# Altium project Krets_Brillz_V2.PrjPcb
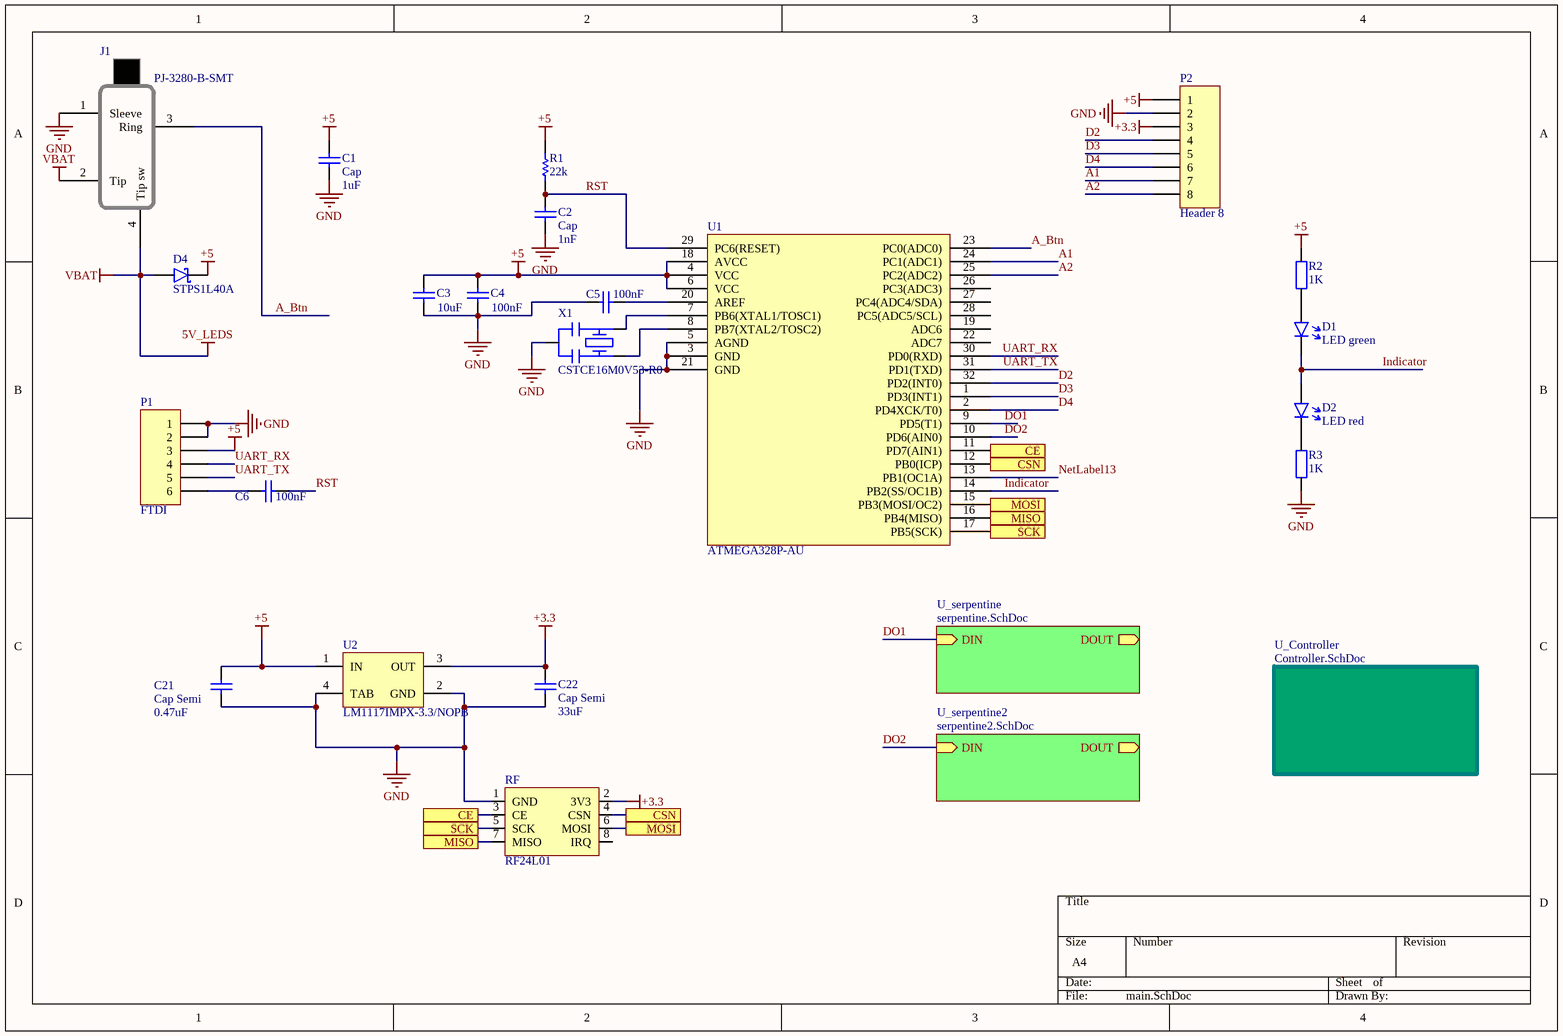
[diagram p0: main.SchDoc]
5 sheets, 147 parts. Net scope: hierarchical (ports join the sheet entries above them; power ports are global).
Board files: SchematicBKP.PcbDoc, PCB1.PcbDoc
Sheets:
  main.SchDoc
    U_Controller = Controller.SchDoc
    U_serpentine = serpentine.SchDoc
      U_Column1 = Column.SchDoc
      U_Column2 = Column.SchDoc
      U_Column3 = Column.SchDoc
      U_Column4 = Column.SchDoc
      U_Column5 = Column.SchDoc
      U_Column6 = Column.SchDoc
      U_Column7 = Column.SchDoc
    U_serpentine2 = serpentine2.SchDoc
      U_Column8 = Column.SchDoc
      U_Column9 = Column.SchDoc
      U_Column10 = Column.SchDoc
      U_Column12 = Column.SchDoc
      U_Column13 = Column.SchDoc
      U_Column14 = Column.SchDoc
      U_Column15 = Column.SchDoc

## Sheet main.SchDoc
size A4

### Parts
(Parts that share a designator on the sheet are numbered #1, #2 ... from top to bottom, then left to right.)
C1  Cap  value 1uF  [6-0805_M]
C2  Cap  value 1nF  [6-0805_N]
C3  value 10uF  [6-0805_N]  (hidden comment: Cap)
C4  value 100nF  [6-0805_N]  (hidden comment: Cap)
C5  value 100nF  [6-0805_N]  (hidden comment: Cap)
C6  value 100nF  [6-0805_N]  (hidden comment: Cap)
C21  Cap Semi  value 0.47uF  [C1206]
C22  Cap Semi  value 33uF  [C1206]
D1  LED green  [LED0805]
D2  LED red  [LED0805]
D4  STPS1L40A  [schottky smd]
J1  PJ-3280-B-SMT  [Phonejack]
P1  FTDI  [HDR1X6H]
P2#1  Header 8  [HDR1X8]
R1  22k  [6-0805_N]
R2  1K  [RES0805]
R3  1K  [RES0805]
RF  RF24L01  [RF]
U1  ATMEGA328P-AU  [TQFP32]
U2  LM1117IMPX-3.3/NOPB  [DCY0004A_N]
X1  CSTCE16M0V53-R0  [osc]

### Sub-sheets
U_Controller = Controller.SchDoc: no entries
U_serpentine = serpentine.SchDoc: DIN (in), DOUT (out)
U_serpentine2 = serpentine2.SchDoc: DIN (in), DOUT (out)

### Ports
CE, CSN, MISO, MOSI, SCK

### Nets
5V_LEDS: D4.1(A) J1.2(Tip) J1.4(Tip_sw)  [also labelled VBAT]
+3.3: C22.2 P2#1.3 RF.2(3V3) U2.3(OUT)
+5: C1.1 C3.1 C4.1 C21.2 D4.2(C) P1.3 P2#1.1 R1.2 R2.1 U1.4(VCC) U1.6(VCC) U1.18(AVCC) U2.1(IN)
GND: C1.2 C2.1 C3.2 C4.2 C5.2 C21.1 C22.1 J1.1(Sleeve) P1.1 P1.2 P2#1.2 R3.2 RF.1(GND) U1.3(GND) U1.5(AGND) U1.21(GND) U2.2(GND) U2.4(TAB) X1.GND
A1: P2#1.7 U1.24(PC1(ADC1))
A2: P2#1.8 U1.25(PC2(ADC2))
A_Btn: J1.3(Ring) U1.23(PC0(ADC0))
D2: P2#1.4 U1.32(PD2(INT0))
D3: P2#1.5 U1.1(PD3(INT1))
D4: P2#1.6 U1.2(PD4XCK/T0))
DO1: U1.9(PD5(T1)) ; sheet U_serpentine/DIN
DO2: U1.10(PD6(AIN0)) ; sheet U_serpentine2/DIN
Indicator: D1.2 D2.1(A) U1.14(PB2(SS/OC1B))
NetLabel13: U1.13(PB1(OC1A))
RST: C2.2 C6.1 R1.1 U1.29(PC6(RESET))
UART_RX: P1.4 U1.30(PD0(RXD))
UART_TX: P1.5 U1.31(PD1(TXD))
NetC5_1: C5.1 U1.20(AREF)
NetC6_2: C6.2 P1.6
NetD1_1: D1.1(A) R2.2
NetD2_2: D2.2 R3.1
NetRF_3: RF.3(CE) U1.11(PD7(AIN1)) ; port CE
NetRF_4: RF.4(CSN) U1.12(PB0(ICP)) ; port CSN
NetRF_5: RF.5(SCK) U1.17(PB5(SCK)) ; port SCK
NetRF_6: RF.6(MOSI) U1.15(PB3(MOSI/OC2)) ; port MOSI
NetRF_7: RF.7(MISO) U1.16(PB4(MISO)) ; port MISO
NetU1_7: U1.7(PB6(XTAL1/TOSC1)) X1.OSCO
NetU1_8: U1.8(PB7(XTAL2/TOSC2)) X1.OSCI

Not connected (* = marked no-connect by the designer): RF 8(IRQ); U1 19(ADC6) 22(ADC7) 26(PC3(ADC3)) 27(PC4(ADC4/SDA)) 28(PC5(ADC5/SCL))

### Library data of the parts
C1 = Cap: C107456; Published: 8-Jun-2000; LatestRevisionDate: 17-Jul-2002; LatestRevisionNote: Re-released for DXP Platform.; PackageReference: RAD-0.3; Publisher: Altium Limited; PackageDescription: Radial Cap, Thru-Hole; 2 Leads; 0.3 in Pin Spacing
C2 = Cap: C393688; Published: 8-Jun-2000; LatestRevisionDate: 17-Jul-2002; LatestRevisionNote: Re-released for DXP Platform.; PackageReference: RAD-0.3; Publisher: Altium Limited; PackageDescription: Radial Cap, Thru-Hole; 2 Leads; 0.3 in Pin Spacing
C3 = Cap: C40894; Published: 8-Jun-2000; LatestRevisionDate: 17-Jul-2002; LatestRevisionNote: Re-released for DXP Platform.; PackageReference: RAD-0.3; Publisher: Altium Limited; PackageDescription: Radial Cap, Thru-Hole; 2 Leads; 0.3 in Pin Spacing
C4-C6 = Cap: C282730; Published: 8-Jun-2000; LatestRevisionDate: 17-Jul-2002; LatestRevisionNote: Re-released for DXP Platform.; PackageReference: RAD-0.3; Publisher: Altium Limited; PackageDescription: Radial Cap, Thru-Hole; 2 Leads; 0.3 in Pin Spacing
C21 = Cap Semi: C161276; Published: 8-Jun-2000; LatestRevisionDate: 29-May-2009; LatestRevisionNote: IPC-7351 Footprint Added.; PackageReference: C1206; Publisher: Altium Limited; PackageDescription: Chip Capacitor
C22 = Cap Semi: C342307; Published: 8-Jun-2000; LatestRevisionDate: 29-May-2009; LatestRevisionNote: IPC-7351 Footprint Added.; PackageReference: C1206; Publisher: Altium Limited; PackageDescription: Chip Capacitor
D1 = LED single: C84260
D2 = LED single: C84256
D4 = schottky: C165940
J1 = Phonejack: C381130
P1 = Header 6H: Header, 6-Pin, Right Angle; LatestRevisionDate: 17-Jul-2002; LatestRevisionNote: Re-released for DXP Platform.; Publisher: Altium Limited
P2#1 = Header 8: Header, 8-Pin; LatestRevisionDate: 17-Jul-2002; LatestRevisionNote: Re-released for DXP Platform.; Publisher: Altium Limited
R1 = Res1: C269535; Published: 8-Jun-2000; LatestRevisionDate: 17-Jul-2002; LatestRevisionNote: Re-released for DXP Platform.; PackageReference: AXIAL-0.3; Publisher: Altium Limited; PackageDescription: Axial Device, Thru-Hole; 2 Leads; 0.3 in Pin Spacing; Value: 22k
R2 R3 = Resistor: C269744
U1 = ATmega328: C14877
U2 = CMP-0062-01784-3: C23984; Manufacturer: Texas Instruments; PowerWise: N; CompType: LDO IC; PackageTopMarking: XYTT*N00A; Code_IPC: SOT223-4; PackageReference: DCY0004A; ComponentLink1Description: Datasheet URL; PackageDescription: Molded SOT-223, 6.50 x 3.56 x 1.6mm Body, 4 Lead, 2.3mm Pitch; PinCount: 4; RoHS: Y; ComponentLink1URL: http://www.ti.com/general/docs/lit/getliterature.tsp?genericPartNumber=LM340-N&fileType=pdf; Code_JEDEC: TO-261-AA
X1 = xtal_1: C32180

## Sheet Controller.SchDoc
size A4
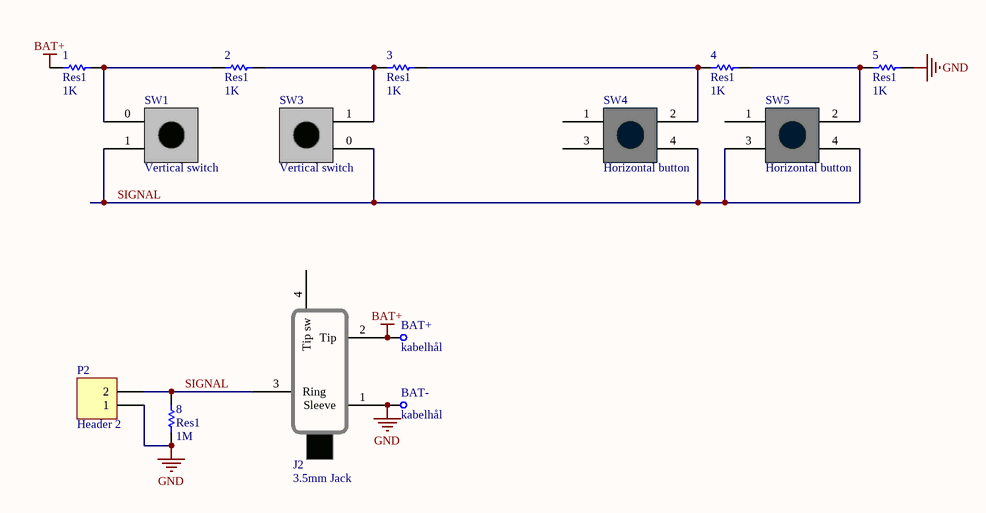
[diagram p1: Controller.SchDoc]

### Parts
(Parts that share a designator on the sheet are numbered #1, #2 ... from top to bottom, then left to right.)
1  Res1  value 1K  [6-0805_N]
2  Res1  value 1K  [6-0805_N]
3  Res1  value 1K  [6-0805_N]
4  Res1  value 1K  [6-0805_N]
5  Res1  value 1K  [6-0805_N]
8  Res1  value 1M  [6-0805_M]
BAT+  kabelhål  [kabelhål USB]
BAT-  kabelhål  [kabelhål USB]
J2  3.5mm Jack  [Phonejack]
P2#2  Header 2  [HDR1X2]
SW1  Vertical switch  [Btn_Vert]
SW3  Vertical switch  [Btn_Vert]
SW4  Horizontal button  [Btn_Horiz]
SW5  Horizontal button  [Btn_Horiz]

### Nets
BAT+: 1.2 BAT+.1 J2.2(Tip)
GND: 5.1 8.2 BAT-.1 J2.1(Sleeve) P2#2.1
SIGNAL: 8.1 J2.3(Ring) P2#2.2 SW1.1 SW3.0 SW4.4 SW5.3 SW5.4
Net1_1: 1.1 2.2 SW1.0
Net2_1: 2.1 3.2 SW3.1
Net3_1: 3.1 4.2 SW4.2
Net4_1: 4.1 5.2 SW5.2

Not connected (* = marked no-connect by the designer): J2 4(Tip_sw); SW4 1 3; SW5 1

### Library data of the parts
1-5 = Res1: C269531; Published: 8-Jun-2000; LatestRevisionDate: 17-Jul-2002; LatestRevisionNote: Re-released for DXP Platform.; PackageReference: AXIAL-0.3; Publisher: Altium Limited; PackageDescription: Axial Device, Thru-Hole; 2 Leads; 0.3 in Pin Spacing
8 = Res1: C269728; Published: 8-Jun-2000; LatestRevisionDate: 17-Jul-2002; LatestRevisionNote: Re-released for DXP Platform.; PackageReference: AXIAL-0.3; Publisher: Altium Limited; PackageDescription: Axial Device, Thru-Hole; 2 Leads; 0.3 in Pin Spacing
J2 = Phonejack: C381130
P2#2 = Header 2: C109361; LatestRevisionDate: 17-Jul-2002; LatestRevisionNote: Re-released for DXP Platform.; Publisher: Altium Limited
SW1 SW3 = SWVERT: C294508
SW4 SW5 = HORIZBTN: C127506

## Sheet serpentine.SchDoc
size A4
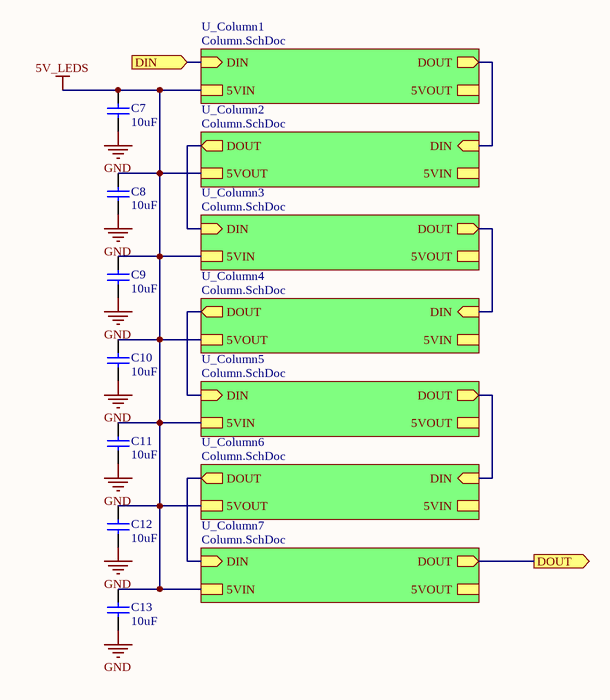
[diagram p2: serpentine.SchDoc]

### Parts
C7  10uF  [CAP1206]
C8  10uF  [CAP1206]
C9  10uF  [CAP1206]
C10  10uF  [CAP1206]
C11  10uF  [CAP1206]
C12  10uF  [CAP1206]
C13  10uF  [CAP1206]

### Sub-sheets
U_Column1 = Column.SchDoc: DIN (in), DOUT (out), 5VIN, 5VOUT
U_Column2 = Column.SchDoc: DIN (in), DOUT (out), 5VIN, 5VOUT
U_Column3 = Column.SchDoc: DIN (in), DOUT (out), 5VIN, 5VOUT
U_Column4 = Column.SchDoc: DIN (in), DOUT (out), 5VIN, 5VOUT
U_Column5 = Column.SchDoc: DIN (in), DOUT (out), 5VIN, 5VOUT
U_Column6 = Column.SchDoc: DIN (in), DOUT (out), 5VIN, 5VOUT
U_Column7 = Column.SchDoc: DIN (in), DOUT (out), 5VIN, 5VOUT

### Ports
DIN (in), DOUT (out)

### Nets
5V_LEDS: C7.2 C8.2 C9.2 C10.2 C11.2 C12.2 C13.2 ; sheet U_Column1/5VIN, sheet U_Column1/5VOUT, sheet U_Column2/5VIN, sheet U_Column2/5VOUT, sheet U_Column3/5VIN, sheet U_Column3/5VOUT, sheet U_Column4/5VIN, sheet U_Column4/5VOUT, sheet U_Column5/5VIN, sheet U_Column5/5VOUT, sheet U_Column6/5VIN, sheet U_Column6/5VOUT, sheet U_Column7/5VIN, sheet U_Column7/5VOUT
GND: C7.1 C8.1 C9.1 C10.1 C11.1 C12.1 C13.1
DO1: port DIN, sheet U_Column1/DIN
NetLD1_U_Column2_4: sheet U_Column1/DOUT, sheet U_Column2/DIN
NetLD1_U_Column3_4: sheet U_Column2/DOUT, sheet U_Column3/DIN
NetLD1_U_Column4_4: sheet U_Column3/DOUT, sheet U_Column4/DIN
NetLD1_U_Column5_4: sheet U_Column4/DOUT, sheet U_Column5/DIN
NetLD1_U_Column6_4: sheet U_Column5/DOUT, sheet U_Column6/DIN
NetLD1_U_Column7_4: sheet U_Column6/DOUT, sheet U_Column7/DIN
NetLD7_U_Column7_2: port DOUT, sheet U_Column7/DOUT

### Library data of the parts
C7-C13 = CAP: C342827; Value: 1µF; Rated voltage: 25V; Tolerance: 10%; Manufacturer: *; Manufacturer P/N: *; Order code Farnell: 1288202RL; Power: *; Technology: X5R; Temperature  Factor: *; Temperature Max: +125°C; Temperature Min: -55°C; STS Code: *

## Sheet Column.SchDoc
size A4
Used 14 times, as channels U_serpentine/U_Column1, U_serpentine/U_Column2, U_serpentine/U_Column3, U_serpentine/U_Column4, U_serpentine/U_Column5, U_serpentine/U_Column6, U_serpentine/U_Column7, U_serpentine2/U_Column8, U_serpentine2/U_Column9, U_serpentine2/U_Column10, U_serpentine2/U_Column12, U_serpentine2/U_Column13, U_serpentine2/U_Column14, U_serpentine2/U_Column15. Parts and nets are listed once, with the designators drawn on the sheet.
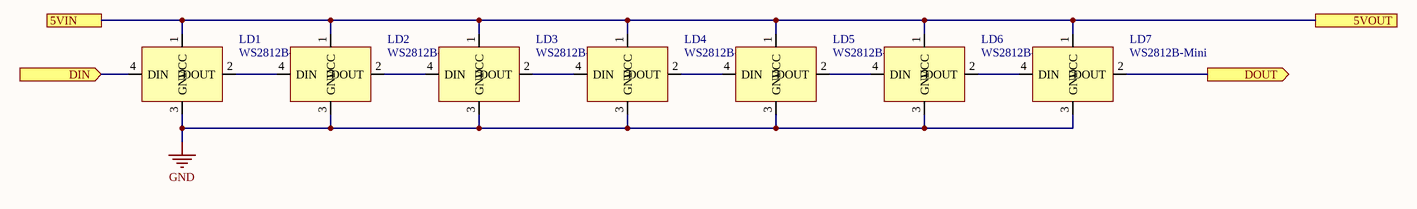
[diagram p3: Column.SchDoc]

### Parts
LD1  WS2812B-Mini  [WS2812B-Mini]
LD2  WS2812B-Mini  [WS2812B-Mini]
LD3  WS2812B-Mini  [WS2812B-Mini]
LD4  WS2812B-Mini  [WS2812B-Mini]
LD5  WS2812B-Mini  [WS2812B-Mini]
LD6  WS2812B-Mini  [WS2812B-Mini]
LD7  WS2812B-Mini  [WS2812B-Mini]

### Ports
5VIN, 5VOUT, DIN (in), DOUT (out)

### Nets
GND: LD1.3(GND) LD2.3(GND) LD3.3(GND) LD4.3(GND) LD5.3(GND) LD6.3(GND) LD7.3(GND)
5VIN: LD1.1(VCC) LD2.1(VCC) LD3.1(VCC) LD4.1(VCC) LD5.1(VCC) LD6.1(VCC) LD7.1(VCC) ; port 5VIN, port 5VOUT
DIN: LD1.4(DIN) ; port DIN
DOUT: LD7.2(DOUT) ; port DOUT
NetLD1_2: LD1.2(DOUT) LD2.4(DIN)
NetLD2_2: LD2.2(DOUT) LD3.4(DIN)
NetLD3_2: LD3.2(DOUT) LD4.4(DIN)
NetLD4_2: LD4.2(DOUT) LD5.4(DIN)
NetLD5_2: LD5.2(DOUT) LD6.4(DIN)
NetLD6_2: LD6.2(DOUT) LD7.4(DIN)

### Channels
U_serpentine/U_Column1: designators end in _U_Column1; ports 5VIN=5V_LEDS 5VOUT=5V_LEDS DIN=DO1 DOUT=NetLD1_U_Column2_4
U_serpentine/U_Column2: designators end in _U_Column2; ports 5VIN=5V_LEDS 5VOUT=5V_LEDS DIN=NetLD1_U_Column2_4 DOUT=NetLD1_U_Column3_4
U_serpentine/U_Column3: designators end in _U_Column3; ports 5VIN=5V_LEDS 5VOUT=5V_LEDS DIN=NetLD1_U_Column3_4 DOUT=NetLD1_U_Column4_4
U_serpentine/U_Column4: designators end in _U_Column4; ports 5VIN=5V_LEDS 5VOUT=5V_LEDS DIN=NetLD1_U_Column4_4 DOUT=NetLD1_U_Column5_4
U_serpentine/U_Column5: designators end in _U_Column5; ports 5VIN=5V_LEDS 5VOUT=5V_LEDS DIN=NetLD1_U_Column5_4 DOUT=NetLD1_U_Column6_4
U_serpentine/U_Column6: designators end in _U_Column6; ports 5VIN=5V_LEDS 5VOUT=5V_LEDS DIN=NetLD1_U_Column6_4 DOUT=NetLD1_U_Column7_4
U_serpentine/U_Column7: designators end in _U_Column7; ports 5VIN=5V_LEDS 5VOUT=5V_LEDS DIN=NetLD1_U_Column7_4 DOUT=NetLD7_U_Column7_2
U_serpentine2/U_Column8: designators end in _U_Column8; ports 5VIN=5V_LEDS 5VOUT=5V_LEDS DIN=DO2 DOUT=NetLD1_U_Column9_4
U_serpentine2/U_Column9: designators end in _U_Column9; ports 5VIN=5V_LEDS 5VOUT=5V_LEDS DIN=NetLD1_U_Column9_4 DOUT=NetLD1_U_Column10_4
U_serpentine2/U_Column10: designators end in _U_Column10; ports 5VIN=5V_LEDS 5VOUT=5V_LEDS DIN=NetLD1_U_Column10_4 DOUT=NetLD1_U_Column15_4
U_serpentine2/U_Column12: designators end in _U_Column12; ports 5VIN=5V_LEDS 5VOUT=5V_LEDS DIN=NetLD1_U_Column12_4 DOUT=NetLD1_U_Column13_4
U_serpentine2/U_Column13: designators end in _U_Column13; ports 5VIN=5V_LEDS 5VOUT=5V_LEDS DIN=NetLD1_U_Column13_4 DOUT=NetLD1_U_Column14_4
U_serpentine2/U_Column14: designators end in _U_Column14; ports 5VIN=5V_LEDS 5VOUT=5V_LEDS DIN=NetLD1_U_Column14_4 DOUT=NetLD7_U_Column14_2
U_serpentine2/U_Column15: designators end in _U_Column15; ports 5VIN=5V_LEDS 5VOUT=5V_LEDS DIN=NetLD1_U_Column15_4 DOUT=NetLD1_U_Column12_4

### Library data of the parts
LD1-LD7 = WS2812: C114583

## Sheet serpentine2.SchDoc
size A4
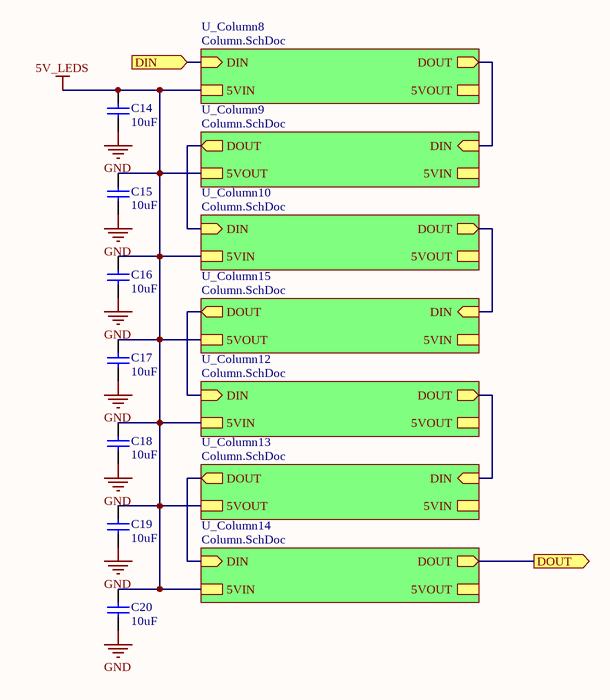
[diagram p4: serpentine2.SchDoc]

### Parts
C14  10uF  [CAP0603]
C15  10uF  [CAP1206]
C16  10uF  [CAP1206]
C17  10uF  [CAP1206]
C18  10uF  [CAP1206]
C19  10uF  [CAP1206]
C20  10uF  [CAP1206]

### Sub-sheets
U_Column8 = Column.SchDoc: DIN (in), DOUT (out), 5VIN, 5VOUT
U_Column9 = Column.SchDoc: DIN (in), DOUT (out), 5VIN, 5VOUT
U_Column10 = Column.SchDoc: DIN (in), DOUT (out), 5VIN, 5VOUT
U_Column12 = Column.SchDoc: DIN (in), DOUT (out), 5VIN, 5VOUT
U_Column13 = Column.SchDoc: DIN (in), DOUT (out), 5VIN, 5VOUT
U_Column14 = Column.SchDoc: DIN (in), DOUT (out), 5VIN, 5VOUT
U_Column15 = Column.SchDoc: DIN (in), DOUT (out), 5VIN, 5VOUT

### Ports
DIN (in), DOUT (out)

### Nets
5V_LEDS: C14.2 C15.2 C16.2 C17.2 C18.2 C19.2 C20.2 ; sheet U_Column8/5VIN, sheet U_Column8/5VOUT, sheet U_Column9/5VIN, sheet U_Column9/5VOUT, sheet U_Column10/5VIN, sheet U_Column10/5VOUT, sheet U_Column12/5VIN, sheet U_Column12/5VOUT, sheet U_Column13/5VIN, sheet U_Column13/5VOUT, sheet U_Column14/5VIN, sheet U_Column14/5VOUT, sheet U_Column15/5VIN, sheet U_Column15/5VOUT
GND: C14.1 C15.1 C16.1 C17.1 C18.1 C19.1 C20.1
DO2: port DIN, sheet U_Column8/DIN
NetLD1_U_Column9_4: sheet U_Column8/DOUT, sheet U_Column9/DIN
NetLD1_U_Column10_4: sheet U_Column9/DOUT, sheet U_Column10/DIN
NetLD1_U_Column12_4: sheet U_Column12/DIN, sheet U_Column15/DOUT
NetLD1_U_Column13_4: sheet U_Column12/DOUT, sheet U_Column13/DIN
NetLD1_U_Column14_4: sheet U_Column13/DOUT, sheet U_Column14/DIN
NetLD1_U_Column15_4: sheet U_Column10/DOUT, sheet U_Column15/DIN
NetLD7_U_Column14_2: port DOUT, sheet U_Column14/DOUT

### Library data of the parts
C14-C20 = CAP: as C7 on sheet serpentine; Manufacturer: *; Manufacturer P/N: *; Order code Farnell: 1288202RL; Power: *; Technology: X5R; Temperature  Factor: *; Temperature Max: +125°C; Temperature Min: -55°C; STS Code: *

## Nets that join several sheets
5V_LEDS: main (D4.1 J1.2 J1.4), serpentine (7 pins), U_serpentine/U_Column1 (7 pins), U_serpentine/U_Column2 (7 pins), U_serpentine/U_Column3 (7 pins), U_serpentine/U_Column4 (7 pins), U_serpentine/U_Column5 (7 pins), U_serpentine/U_Column6 (7 pins), U_serpentine/U_Column7 (7 pins), serpentine2 (7 pins), U_serpentine2/U_Column8 (7 pins), U_serpentine2/U_Column9 (7 pins), U_serpentine2/U_Column10 (7 pins), U_serpentine2/U_Column12 (7 pins), U_serpentine2/U_Column13 (7 pins), U_serpentine2/U_Column14 (7 pins), U_serpentine2/U_Column15 (7 pins)
GND: main (19 pins), Controller (5 pins), serpentine (7 pins), U_serpentine/U_Column1 (7 pins), U_serpentine/U_Column2 (7 pins), U_serpentine/U_Column3 (7 pins), U_serpentine/U_Column4 (7 pins), U_serpentine/U_Column5 (7 pins), U_serpentine/U_Column6 (7 pins), U_serpentine/U_Column7 (7 pins), serpentine2 (7 pins), U_serpentine2/U_Column8 (7 pins), U_serpentine2/U_Column9 (7 pins), U_serpentine2/U_Column10 (7 pins), U_serpentine2/U_Column12 (7 pins), U_serpentine2/U_Column13 (7 pins), U_serpentine2/U_Column14 (7 pins), U_serpentine2/U_Column15 (7 pins)
DO1: main (U1.9), U_serpentine/U_Column1 (LD1_U_Column1.4)
DO2: main (U1.10), U_serpentine2/U_Column8 (LD1_U_Column8.4)
NetLD1_U_Column2_4: U_serpentine/U_Column1 (LD7_U_Column1.2), U_serpentine/U_Column2 (LD1_U_Column2.4)
NetLD1_U_Column3_4: U_serpentine/U_Column2 (LD7_U_Column2.2), U_serpentine/U_Column3 (LD1_U_Column3.4)
NetLD1_U_Column4_4: U_serpentine/U_Column3 (LD7_U_Column3.2), U_serpentine/U_Column4 (LD1_U_Column4.4)
NetLD1_U_Column5_4: U_serpentine/U_Column4 (LD7_U_Column4.2), U_serpentine/U_Column5 (LD1_U_Column5.4)
NetLD1_U_Column6_4: U_serpentine/U_Column5 (LD7_U_Column5.2), U_serpentine/U_Column6 (LD1_U_Column6.4)
NetLD1_U_Column7_4: U_serpentine/U_Column6 (LD7_U_Column6.2), U_serpentine/U_Column7 (LD1_U_Column7.4)
NetLD1_U_Column9_4: U_serpentine2/U_Column8 (LD7_U_Column8.2), U_serpentine2/U_Column9 (LD1_U_Column9.4)
NetLD1_U_Column10_4: U_serpentine2/U_Column9 (LD7_U_Column9.2), U_serpentine2/U_Column10 (LD1_U_Column10.4)
NetLD1_U_Column12_4: U_serpentine2/U_Column12 (LD1_U_Column12.4), U_serpentine2/U_Column15 (LD7_U_Column15.2)
NetLD1_U_Column13_4: U_serpentine2/U_Column12 (LD7_U_Column12.2), U_serpentine2/U_Column13 (LD1_U_Column13.4)
NetLD1_U_Column14_4: U_serpentine2/U_Column13 (LD7_U_Column13.2), U_serpentine2/U_Column14 (LD1_U_Column14.4)
NetLD1_U_Column15_4: U_serpentine2/U_Column10 (LD7_U_Column10.2), U_serpentine2/U_Column15 (LD1_U_Column15.4)